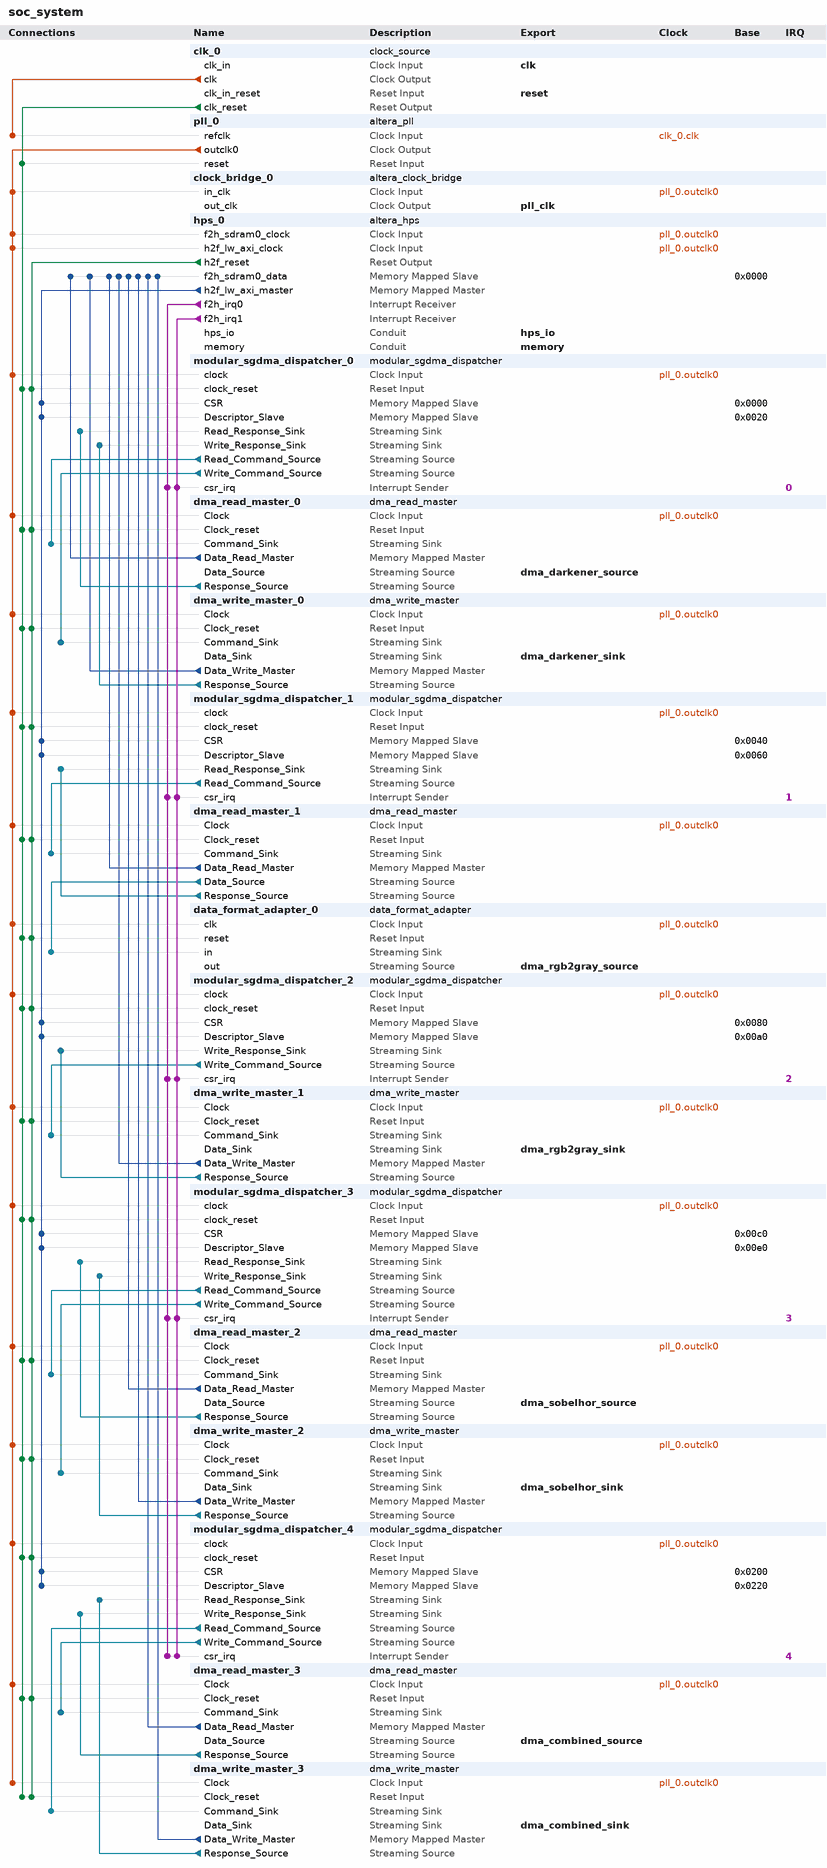
[diagram p0: system contents]
# Platform Designer (Qsys) system soc_system, Cyclone V 5CSEMA5F31C6
# Parameters at their usual value, and those the tool derives, are not listed.
package require -exact qsys 17.1
create_system soc_system
set_project_property DEVICE_FAMILY {Cyclone V}
set_project_property DEVICE 5CSEMA5F31C6

add_instance clk_0 clock_source 17.1
set_instance_parameter_value clk_0 clockFrequency 50000000

add_instance pll_0 altera_pll 17.1
set_instance_parameter_value pll_0 gui_device_speed_grade 1
set_instance_parameter_value pll_0 gui_number_of_clocks 1
set_instance_parameter_value pll_0 gui_operation_mode direct
set_instance_parameter_value pll_0 gui_output_clock_frequency0 100.0
set_instance_parameter_value pll_0 gui_pll_mode {Integer-N PLL}
set_instance_parameter_value pll_0 gui_reference_clock_frequency 50.0
set_instance_parameter_value pll_0 gui_use_locked false

add_instance clock_bridge_0 altera_clock_bridge 17.1
set_instance_parameter_value clock_bridge_0 DERIVED_CLOCK_RATE 100000000
set_instance_parameter_value clock_bridge_0 EXPLICIT_CLOCK_RATE 0

add_instance hps_0 altera_hps 17.1
set_instance_parameter_value hps_0 EMAC1_Mode RGMII
set_instance_parameter_value hps_0 EMAC1_PinMuxing {HPS I/O Set 0}
set_instance_parameter_value hps_0 F2SCLK_COLDRST_Enable false
set_instance_parameter_value hps_0 F2SCLK_DBGRST_Enable false
set_instance_parameter_value hps_0 F2SCLK_WARMRST_Enable false
set_instance_parameter_value hps_0 F2SDRAM_Type {Avalon-MM Bidirectional}
set_instance_parameter_value hps_0 F2SDRAM_Width 64
set_instance_parameter_value hps_0 F2SINTERRUPT_Enable true
set_instance_parameter_value hps_0 F2S_Width 0
set_instance_parameter_value hps_0 FPGA_PERIPHERAL_OUTPUT_CLOCK_FREQ_EMAC0_GTX_CLK 100
set_instance_parameter_value hps_0 FPGA_PERIPHERAL_OUTPUT_CLOCK_FREQ_EMAC0_MD_CLK 100.0
set_instance_parameter_value hps_0 FPGA_PERIPHERAL_OUTPUT_CLOCK_FREQ_EMAC1_GTX_CLK 100
set_instance_parameter_value hps_0 FPGA_PERIPHERAL_OUTPUT_CLOCK_FREQ_EMAC1_MD_CLK 100.0
set_instance_parameter_value hps_0 HPS_PROTOCOL DDR3
set_instance_parameter_value hps_0 I2C0_Mode N/A
set_instance_parameter_value hps_0 I2C0_PinMuxing Unused
set_instance_parameter_value hps_0 I2C1_Mode N/A
set_instance_parameter_value hps_0 I2C1_PinMuxing Unused
set_instance_parameter_value hps_0 LWH2F_Enable true
set_instance_parameter_value hps_0 MEM_BANKADDR_WIDTH 3
set_instance_parameter_value hps_0 MEM_CLK_FREQ 400.0
set_instance_parameter_value hps_0 MEM_COL_ADDR_WIDTH 10
set_instance_parameter_value hps_0 MEM_DQ_WIDTH 32
set_instance_parameter_value hps_0 MEM_DRV_STR RZQ/6
set_instance_parameter_value hps_0 MEM_ROW_ADDR_WIDTH 15
set_instance_parameter_value hps_0 MEM_RTT_NOM RZQ/6
set_instance_parameter_value hps_0 MEM_RTT_WR {Dynamic ODT off}
set_instance_parameter_value hps_0 MEM_TCL 7
set_instance_parameter_value hps_0 MEM_TFAW_NS 45.0
set_instance_parameter_value hps_0 MEM_TRAS_NS 36.0
set_instance_parameter_value hps_0 MEM_TRCD_NS 13.125
set_instance_parameter_value hps_0 MEM_TRFC_NS 300.0
set_instance_parameter_value hps_0 MEM_TRP_NS 13.125
set_instance_parameter_value hps_0 MEM_VENDOR Micron
set_instance_parameter_value hps_0 MEM_WTCL 7
set_instance_parameter_value hps_0 QSPI_Mode N/A
set_instance_parameter_value hps_0 QSPI_PinMuxing Unused
set_instance_parameter_value hps_0 REF_CLK_FREQ 25.0
set_instance_parameter_value hps_0 S2FCLK_USER2CLK 5
set_instance_parameter_value hps_0 S2F_Width 0
set_instance_parameter_value hps_0 SDIO_Mode {4-bit Data}
set_instance_parameter_value hps_0 SDIO_PinMuxing {HPS I/O Set 0}
set_instance_parameter_value hps_0 SPIM1_Mode N/A
set_instance_parameter_value hps_0 SPIM1_PinMuxing Unused
set_instance_parameter_value hps_0 STM_Enable false
set_instance_parameter_value hps_0 TIMING_BOARD_AC_SKEW 0.02
set_instance_parameter_value hps_0 TIMING_BOARD_AC_TO_CK_SKEW 0.01
set_instance_parameter_value hps_0 TIMING_BOARD_DQ_TO_DQS_SKEW 0.05
set_instance_parameter_value hps_0 TIMING_BOARD_MAX_CK_DELAY 0.03
set_instance_parameter_value hps_0 TIMING_BOARD_MAX_DQS_DELAY 0.02
set_instance_parameter_value hps_0 TIMING_BOARD_SKEW_BETWEEN_DQS 0.06
set_instance_parameter_value hps_0 TIMING_BOARD_SKEW_CKDQS_DIMM_MAX 0.12
set_instance_parameter_value hps_0 TIMING_BOARD_SKEW_CKDQS_DIMM_MIN 0.06
set_instance_parameter_value hps_0 TIMING_BOARD_SKEW_WITHIN_DQS 0.01
set_instance_parameter_value hps_0 TIMING_TDH 65
set_instance_parameter_value hps_0 TIMING_TDQSCK 255
set_instance_parameter_value hps_0 TIMING_TDQSQ 125
set_instance_parameter_value hps_0 TIMING_TDS 30
set_instance_parameter_value hps_0 TIMING_TIH 140
set_instance_parameter_value hps_0 TIMING_TIS 190
set_instance_parameter_value hps_0 TIMING_TQSH 0.4
set_instance_parameter_value hps_0 UART0_Mode {No Flow Control}
set_instance_parameter_value hps_0 UART0_PinMuxing {HPS I/O Set 0}
set_instance_parameter_value hps_0 USB1_Mode N/A
set_instance_parameter_value hps_0 USB1_PinMuxing Unused
set_instance_parameter_value hps_0 desired_cfg_clk_mhz 100.0
set_instance_parameter_value hps_0 desired_qspi_clk_mhz 400.0
set_instance_parameter_value hps_0 use_default_mpu_clk false

add_instance modular_sgdma_dispatcher_0 modular_sgdma_dispatcher 17.1
set_instance_parameter_value modular_sgdma_dispatcher_0 BURST_ENABLE 0
set_instance_parameter_value modular_sgdma_dispatcher_0 BURST_WRAPPING_SUPPORT 0
set_instance_parameter_value modular_sgdma_dispatcher_0 CSR_ADDRESS_WIDTH 3
set_instance_parameter_value modular_sgdma_dispatcher_0 DATA_FIFO_DEPTH 32
set_instance_parameter_value modular_sgdma_dispatcher_0 DATA_WIDTH 32
set_instance_parameter_value modular_sgdma_dispatcher_0 DESCRIPTOR_FIFO_DEPTH 8
set_instance_parameter_value modular_sgdma_dispatcher_0 ENHANCED_FEATURES 0
set_instance_parameter_value modular_sgdma_dispatcher_0 GUI_RESPONSE_PORT 2
set_instance_parameter_value modular_sgdma_dispatcher_0 MAX_BURST_COUNT 2
set_instance_parameter_value modular_sgdma_dispatcher_0 MAX_BYTE 1024
set_instance_parameter_value modular_sgdma_dispatcher_0 MAX_STRIDE 1
set_instance_parameter_value modular_sgdma_dispatcher_0 MODE 0
set_instance_parameter_value modular_sgdma_dispatcher_0 PREFETCHER_USE_CASE 0
set_instance_parameter_value modular_sgdma_dispatcher_0 PROGRAMMABLE_BURST_ENABLE 0
set_instance_parameter_value modular_sgdma_dispatcher_0 STRIDE_ENABLE 0
set_instance_parameter_value modular_sgdma_dispatcher_0 TRANSFER_TYPE {Aligned Accesses}

add_instance dma_read_master_0 dma_read_master 17.1
set_instance_parameter_value dma_read_master_0 BURST_ENABLE 1
set_instance_parameter_value dma_read_master_0 CHANNEL_ENABLE 0
set_instance_parameter_value dma_read_master_0 CHANNEL_WIDTH 8
set_instance_parameter_value dma_read_master_0 DATA_WIDTH 8
set_instance_parameter_value dma_read_master_0 ERROR_ENABLE 0
set_instance_parameter_value dma_read_master_0 ERROR_WIDTH 8
set_instance_parameter_value dma_read_master_0 FIFO_DEPTH 64
set_instance_parameter_value dma_read_master_0 FIFO_SPEED_OPTIMIZATION 1
set_instance_parameter_value dma_read_master_0 FIX_ADDRESS_WIDTH 32
set_instance_parameter_value dma_read_master_0 GUI_BURST_WRAPPING_SUPPORT 0
set_instance_parameter_value dma_read_master_0 GUI_MAX_BURST_COUNT 16
set_instance_parameter_value dma_read_master_0 GUI_PROGRAMMABLE_BURST_ENABLE 0
set_instance_parameter_value dma_read_master_0 GUI_STRIDE_WIDTH 1
set_instance_parameter_value dma_read_master_0 LENGTH_WIDTH 32
set_instance_parameter_value dma_read_master_0 PACKET_ENABLE 0
set_instance_parameter_value dma_read_master_0 STRIDE_ENABLE 0
set_instance_parameter_value dma_read_master_0 TRANSFER_TYPE {Aligned Accesses}
set_instance_parameter_value dma_read_master_0 USE_FIX_ADDRESS_WIDTH 0

add_instance dma_write_master_0 dma_write_master 17.1
set_instance_parameter_value dma_write_master_0 BURST_ENABLE 1
set_instance_parameter_value dma_write_master_0 DATA_WIDTH 8
set_instance_parameter_value dma_write_master_0 ERROR_ENABLE 0
set_instance_parameter_value dma_write_master_0 ERROR_WIDTH 8
set_instance_parameter_value dma_write_master_0 FIFO_DEPTH 64
set_instance_parameter_value dma_write_master_0 FIFO_SPEED_OPTIMIZATION 1
set_instance_parameter_value dma_write_master_0 FIX_ADDRESS_WIDTH 32
set_instance_parameter_value dma_write_master_0 GUI_BURST_WRAPPING_SUPPORT 0
set_instance_parameter_value dma_write_master_0 GUI_MAX_BURST_COUNT 16
set_instance_parameter_value dma_write_master_0 GUI_PROGRAMMABLE_BURST_ENABLE 0
set_instance_parameter_value dma_write_master_0 GUI_STRIDE_WIDTH 1
set_instance_parameter_value dma_write_master_0 LENGTH_WIDTH 32
set_instance_parameter_value dma_write_master_0 PACKET_ENABLE 0
set_instance_parameter_value dma_write_master_0 STRIDE_ENABLE 0
set_instance_parameter_value dma_write_master_0 TRANSFER_TYPE {Aligned Accesses}
set_instance_parameter_value dma_write_master_0 USE_FIX_ADDRESS_WIDTH 0

add_instance modular_sgdma_dispatcher_1 modular_sgdma_dispatcher 17.1
set_instance_parameter_value modular_sgdma_dispatcher_1 BURST_ENABLE 0
set_instance_parameter_value modular_sgdma_dispatcher_1 BURST_WRAPPING_SUPPORT 0
set_instance_parameter_value modular_sgdma_dispatcher_1 CSR_ADDRESS_WIDTH 3
set_instance_parameter_value modular_sgdma_dispatcher_1 DATA_FIFO_DEPTH 32
set_instance_parameter_value modular_sgdma_dispatcher_1 DATA_WIDTH 32
set_instance_parameter_value modular_sgdma_dispatcher_1 DESCRIPTOR_FIFO_DEPTH 8
set_instance_parameter_value modular_sgdma_dispatcher_1 ENHANCED_FEATURES 0
set_instance_parameter_value modular_sgdma_dispatcher_1 GUI_RESPONSE_PORT 0
set_instance_parameter_value modular_sgdma_dispatcher_1 MAX_BURST_COUNT 2
set_instance_parameter_value modular_sgdma_dispatcher_1 MAX_BYTE 1024
set_instance_parameter_value modular_sgdma_dispatcher_1 MAX_STRIDE 1
set_instance_parameter_value modular_sgdma_dispatcher_1 MODE 1
set_instance_parameter_value modular_sgdma_dispatcher_1 PREFETCHER_USE_CASE 0
set_instance_parameter_value modular_sgdma_dispatcher_1 PROGRAMMABLE_BURST_ENABLE 0
set_instance_parameter_value modular_sgdma_dispatcher_1 STRIDE_ENABLE 0
set_instance_parameter_value modular_sgdma_dispatcher_1 TRANSFER_TYPE {Aligned Accesses}

add_instance dma_read_master_1 dma_read_master 17.1
set_instance_parameter_value dma_read_master_1 BURST_ENABLE 1
set_instance_parameter_value dma_read_master_1 CHANNEL_ENABLE 0
set_instance_parameter_value dma_read_master_1 CHANNEL_WIDTH 8
set_instance_parameter_value dma_read_master_1 DATA_WIDTH 64
set_instance_parameter_value dma_read_master_1 ERROR_ENABLE 0
set_instance_parameter_value dma_read_master_1 ERROR_WIDTH 8
set_instance_parameter_value dma_read_master_1 FIFO_DEPTH 64
set_instance_parameter_value dma_read_master_1 FIFO_SPEED_OPTIMIZATION 1
set_instance_parameter_value dma_read_master_1 FIX_ADDRESS_WIDTH 32
set_instance_parameter_value dma_read_master_1 GUI_BURST_WRAPPING_SUPPORT 0
set_instance_parameter_value dma_read_master_1 GUI_MAX_BURST_COUNT 16
set_instance_parameter_value dma_read_master_1 GUI_PROGRAMMABLE_BURST_ENABLE 0
set_instance_parameter_value dma_read_master_1 GUI_STRIDE_WIDTH 1
set_instance_parameter_value dma_read_master_1 LENGTH_WIDTH 32
set_instance_parameter_value dma_read_master_1 PACKET_ENABLE 0
set_instance_parameter_value dma_read_master_1 STRIDE_ENABLE 0
set_instance_parameter_value dma_read_master_1 TRANSFER_TYPE {Aligned Accesses}
set_instance_parameter_value dma_read_master_1 USE_FIX_ADDRESS_WIDTH 0

add_instance data_format_adapter_0 data_format_adapter 17.1
set_instance_parameter_value data_format_adapter_0 inBitsPerSymbol 8
set_instance_parameter_value data_format_adapter_0 inChannelWidth 0
set_instance_parameter_value data_format_adapter_0 inErrorWidth 0
set_instance_parameter_value data_format_adapter_0 inMaxChannel 0
set_instance_parameter_value data_format_adapter_0 inReadyLatency 0
set_instance_parameter_value data_format_adapter_0 inSymbolsPerBeat 8
set_instance_parameter_value data_format_adapter_0 inUseEmpty false
set_instance_parameter_value data_format_adapter_0 inUseEmptyPort AUTO
set_instance_parameter_value data_format_adapter_0 inUsePackets false
set_instance_parameter_value data_format_adapter_0 outSymbolsPerBeat 3
set_instance_parameter_value data_format_adapter_0 outUseEmpty false
set_instance_parameter_value data_format_adapter_0 outUseEmptyPort AUTO

add_instance modular_sgdma_dispatcher_2 modular_sgdma_dispatcher 17.1
set_instance_parameter_value modular_sgdma_dispatcher_2 BURST_ENABLE 0
set_instance_parameter_value modular_sgdma_dispatcher_2 BURST_WRAPPING_SUPPORT 0
set_instance_parameter_value modular_sgdma_dispatcher_2 CSR_ADDRESS_WIDTH 3
set_instance_parameter_value modular_sgdma_dispatcher_2 DATA_FIFO_DEPTH 32
set_instance_parameter_value modular_sgdma_dispatcher_2 DATA_WIDTH 32
set_instance_parameter_value modular_sgdma_dispatcher_2 DESCRIPTOR_FIFO_DEPTH 8
set_instance_parameter_value modular_sgdma_dispatcher_2 ENHANCED_FEATURES 0
set_instance_parameter_value modular_sgdma_dispatcher_2 GUI_RESPONSE_PORT 2
set_instance_parameter_value modular_sgdma_dispatcher_2 MAX_BURST_COUNT 2
set_instance_parameter_value modular_sgdma_dispatcher_2 MAX_BYTE 1024
set_instance_parameter_value modular_sgdma_dispatcher_2 MAX_STRIDE 1
set_instance_parameter_value modular_sgdma_dispatcher_2 MODE 2
set_instance_parameter_value modular_sgdma_dispatcher_2 PREFETCHER_USE_CASE 0
set_instance_parameter_value modular_sgdma_dispatcher_2 PROGRAMMABLE_BURST_ENABLE 0
set_instance_parameter_value modular_sgdma_dispatcher_2 STRIDE_ENABLE 0
set_instance_parameter_value modular_sgdma_dispatcher_2 TRANSFER_TYPE {Aligned Accesses}

add_instance dma_write_master_1 dma_write_master 17.1
set_instance_parameter_value dma_write_master_1 BURST_ENABLE 1
set_instance_parameter_value dma_write_master_1 DATA_WIDTH 8
set_instance_parameter_value dma_write_master_1 ERROR_ENABLE 0
set_instance_parameter_value dma_write_master_1 ERROR_WIDTH 8
set_instance_parameter_value dma_write_master_1 FIFO_DEPTH 64
set_instance_parameter_value dma_write_master_1 FIFO_SPEED_OPTIMIZATION 1
set_instance_parameter_value dma_write_master_1 FIX_ADDRESS_WIDTH 32
set_instance_parameter_value dma_write_master_1 GUI_BURST_WRAPPING_SUPPORT 0
set_instance_parameter_value dma_write_master_1 GUI_MAX_BURST_COUNT 16
set_instance_parameter_value dma_write_master_1 GUI_PROGRAMMABLE_BURST_ENABLE 0
set_instance_parameter_value dma_write_master_1 GUI_STRIDE_WIDTH 1
set_instance_parameter_value dma_write_master_1 LENGTH_WIDTH 32
set_instance_parameter_value dma_write_master_1 PACKET_ENABLE 0
set_instance_parameter_value dma_write_master_1 STRIDE_ENABLE 0
set_instance_parameter_value dma_write_master_1 TRANSFER_TYPE {Aligned Accesses}
set_instance_parameter_value dma_write_master_1 USE_FIX_ADDRESS_WIDTH 0

add_instance modular_sgdma_dispatcher_3 modular_sgdma_dispatcher 17.1
set_instance_parameter_value modular_sgdma_dispatcher_3 BURST_ENABLE 0
set_instance_parameter_value modular_sgdma_dispatcher_3 BURST_WRAPPING_SUPPORT 0
set_instance_parameter_value modular_sgdma_dispatcher_3 CSR_ADDRESS_WIDTH 3
set_instance_parameter_value modular_sgdma_dispatcher_3 DATA_FIFO_DEPTH 32
set_instance_parameter_value modular_sgdma_dispatcher_3 DATA_WIDTH 32
set_instance_parameter_value modular_sgdma_dispatcher_3 DESCRIPTOR_FIFO_DEPTH 8
set_instance_parameter_value modular_sgdma_dispatcher_3 ENHANCED_FEATURES 0
set_instance_parameter_value modular_sgdma_dispatcher_3 GUI_RESPONSE_PORT 2
set_instance_parameter_value modular_sgdma_dispatcher_3 MAX_BURST_COUNT 2
set_instance_parameter_value modular_sgdma_dispatcher_3 MAX_BYTE 1024
set_instance_parameter_value modular_sgdma_dispatcher_3 MAX_STRIDE 1
set_instance_parameter_value modular_sgdma_dispatcher_3 MODE 0
set_instance_parameter_value modular_sgdma_dispatcher_3 PREFETCHER_USE_CASE 0
set_instance_parameter_value modular_sgdma_dispatcher_3 PROGRAMMABLE_BURST_ENABLE 0
set_instance_parameter_value modular_sgdma_dispatcher_3 STRIDE_ENABLE 0
set_instance_parameter_value modular_sgdma_dispatcher_3 TRANSFER_TYPE {Aligned Accesses}

add_instance dma_read_master_2 dma_read_master 17.1
set_instance_parameter_value dma_read_master_2 BURST_ENABLE 1
set_instance_parameter_value dma_read_master_2 CHANNEL_ENABLE 0
set_instance_parameter_value dma_read_master_2 CHANNEL_WIDTH 8
set_instance_parameter_value dma_read_master_2 DATA_WIDTH 8
set_instance_parameter_value dma_read_master_2 ERROR_ENABLE 0
set_instance_parameter_value dma_read_master_2 ERROR_WIDTH 8
set_instance_parameter_value dma_read_master_2 FIFO_DEPTH 64
set_instance_parameter_value dma_read_master_2 FIFO_SPEED_OPTIMIZATION 1
set_instance_parameter_value dma_read_master_2 FIX_ADDRESS_WIDTH 32
set_instance_parameter_value dma_read_master_2 GUI_BURST_WRAPPING_SUPPORT 0
set_instance_parameter_value dma_read_master_2 GUI_MAX_BURST_COUNT 16
set_instance_parameter_value dma_read_master_2 GUI_PROGRAMMABLE_BURST_ENABLE 0
set_instance_parameter_value dma_read_master_2 GUI_STRIDE_WIDTH 1
set_instance_parameter_value dma_read_master_2 LENGTH_WIDTH 32
set_instance_parameter_value dma_read_master_2 PACKET_ENABLE 0
set_instance_parameter_value dma_read_master_2 STRIDE_ENABLE 0
set_instance_parameter_value dma_read_master_2 TRANSFER_TYPE {Aligned Accesses}
set_instance_parameter_value dma_read_master_2 USE_FIX_ADDRESS_WIDTH 0

add_instance dma_write_master_2 dma_write_master 17.1
set_instance_parameter_value dma_write_master_2 BURST_ENABLE 1
set_instance_parameter_value dma_write_master_2 DATA_WIDTH 8
set_instance_parameter_value dma_write_master_2 ERROR_ENABLE 0
set_instance_parameter_value dma_write_master_2 ERROR_WIDTH 8
set_instance_parameter_value dma_write_master_2 FIFO_DEPTH 64
set_instance_parameter_value dma_write_master_2 FIFO_SPEED_OPTIMIZATION 1
set_instance_parameter_value dma_write_master_2 FIX_ADDRESS_WIDTH 32
set_instance_parameter_value dma_write_master_2 GUI_BURST_WRAPPING_SUPPORT 0
set_instance_parameter_value dma_write_master_2 GUI_MAX_BURST_COUNT 16
set_instance_parameter_value dma_write_master_2 GUI_PROGRAMMABLE_BURST_ENABLE 0
set_instance_parameter_value dma_write_master_2 GUI_STRIDE_WIDTH 1
set_instance_parameter_value dma_write_master_2 LENGTH_WIDTH 32
set_instance_parameter_value dma_write_master_2 PACKET_ENABLE 0
set_instance_parameter_value dma_write_master_2 STRIDE_ENABLE 0
set_instance_parameter_value dma_write_master_2 TRANSFER_TYPE {Aligned Accesses}
set_instance_parameter_value dma_write_master_2 USE_FIX_ADDRESS_WIDTH 0

add_instance modular_sgdma_dispatcher_4 modular_sgdma_dispatcher 17.1
set_instance_parameter_value modular_sgdma_dispatcher_4 BURST_ENABLE 0
set_instance_parameter_value modular_sgdma_dispatcher_4 BURST_WRAPPING_SUPPORT 0
set_instance_parameter_value modular_sgdma_dispatcher_4 CSR_ADDRESS_WIDTH 3
set_instance_parameter_value modular_sgdma_dispatcher_4 DATA_FIFO_DEPTH 32
set_instance_parameter_value modular_sgdma_dispatcher_4 DATA_WIDTH 32
set_instance_parameter_value modular_sgdma_dispatcher_4 DESCRIPTOR_FIFO_DEPTH 8
set_instance_parameter_value modular_sgdma_dispatcher_4 ENHANCED_FEATURES 0
set_instance_parameter_value modular_sgdma_dispatcher_4 GUI_RESPONSE_PORT 2
set_instance_parameter_value modular_sgdma_dispatcher_4 MAX_BURST_COUNT 2
set_instance_parameter_value modular_sgdma_dispatcher_4 MAX_BYTE 1024
set_instance_parameter_value modular_sgdma_dispatcher_4 MAX_STRIDE 1
set_instance_parameter_value modular_sgdma_dispatcher_4 MODE 0
set_instance_parameter_value modular_sgdma_dispatcher_4 PREFETCHER_USE_CASE 0
set_instance_parameter_value modular_sgdma_dispatcher_4 PROGRAMMABLE_BURST_ENABLE 0
set_instance_parameter_value modular_sgdma_dispatcher_4 STRIDE_ENABLE 0
set_instance_parameter_value modular_sgdma_dispatcher_4 TRANSFER_TYPE {Aligned Accesses}

add_instance dma_read_master_3 dma_read_master 17.1
set_instance_parameter_value dma_read_master_3 BURST_ENABLE 1
set_instance_parameter_value dma_read_master_3 CHANNEL_ENABLE 0
set_instance_parameter_value dma_read_master_3 CHANNEL_WIDTH 8
set_instance_parameter_value dma_read_master_3 DATA_WIDTH 8
set_instance_parameter_value dma_read_master_3 ERROR_ENABLE 0
set_instance_parameter_value dma_read_master_3 ERROR_WIDTH 8
set_instance_parameter_value dma_read_master_3 FIFO_DEPTH 64
set_instance_parameter_value dma_read_master_3 FIFO_SPEED_OPTIMIZATION 1
set_instance_parameter_value dma_read_master_3 FIX_ADDRESS_WIDTH 32
set_instance_parameter_value dma_read_master_3 GUI_BURST_WRAPPING_SUPPORT 0
set_instance_parameter_value dma_read_master_3 GUI_MAX_BURST_COUNT 16
set_instance_parameter_value dma_read_master_3 GUI_PROGRAMMABLE_BURST_ENABLE 0
set_instance_parameter_value dma_read_master_3 GUI_STRIDE_WIDTH 1
set_instance_parameter_value dma_read_master_3 LENGTH_WIDTH 32
set_instance_parameter_value dma_read_master_3 PACKET_ENABLE 0
set_instance_parameter_value dma_read_master_3 STRIDE_ENABLE 0
set_instance_parameter_value dma_read_master_3 TRANSFER_TYPE {Aligned Accesses}
set_instance_parameter_value dma_read_master_3 USE_FIX_ADDRESS_WIDTH 0

add_instance dma_write_master_3 dma_write_master 17.1
set_instance_parameter_value dma_write_master_3 BURST_ENABLE 1
set_instance_parameter_value dma_write_master_3 DATA_WIDTH 8
set_instance_parameter_value dma_write_master_3 ERROR_ENABLE 0
set_instance_parameter_value dma_write_master_3 ERROR_WIDTH 8
set_instance_parameter_value dma_write_master_3 FIFO_DEPTH 64
set_instance_parameter_value dma_write_master_3 FIFO_SPEED_OPTIMIZATION 1
set_instance_parameter_value dma_write_master_3 FIX_ADDRESS_WIDTH 32
set_instance_parameter_value dma_write_master_3 GUI_BURST_WRAPPING_SUPPORT 0
set_instance_parameter_value dma_write_master_3 GUI_MAX_BURST_COUNT 16
set_instance_parameter_value dma_write_master_3 GUI_PROGRAMMABLE_BURST_ENABLE 0
set_instance_parameter_value dma_write_master_3 GUI_STRIDE_WIDTH 1
set_instance_parameter_value dma_write_master_3 LENGTH_WIDTH 32
set_instance_parameter_value dma_write_master_3 PACKET_ENABLE 0
set_instance_parameter_value dma_write_master_3 STRIDE_ENABLE 0
set_instance_parameter_value dma_write_master_3 TRANSFER_TYPE {Aligned Accesses}
set_instance_parameter_value dma_write_master_3 USE_FIX_ADDRESS_WIDTH 0

# connections
add_connection clk_0.clk pll_0.refclk clock
add_connection pll_0.outclk0 clock_bridge_0.in_clk clock
add_connection pll_0.outclk0 data_format_adapter_0.clk clock
add_connection pll_0.outclk0 dma_read_master_0.Clock clock
add_connection pll_0.outclk0 dma_read_master_1.Clock clock
add_connection pll_0.outclk0 dma_read_master_2.Clock clock
add_connection pll_0.outclk0 dma_read_master_3.Clock clock
add_connection pll_0.outclk0 dma_write_master_0.Clock clock
add_connection pll_0.outclk0 dma_write_master_1.Clock clock
add_connection pll_0.outclk0 dma_write_master_2.Clock clock
add_connection pll_0.outclk0 dma_write_master_3.Clock clock
add_connection pll_0.outclk0 hps_0.f2h_sdram0_clock clock
add_connection pll_0.outclk0 hps_0.h2f_lw_axi_clock clock
add_connection pll_0.outclk0 modular_sgdma_dispatcher_0.clock clock
add_connection pll_0.outclk0 modular_sgdma_dispatcher_1.clock clock
add_connection pll_0.outclk0 modular_sgdma_dispatcher_2.clock clock
add_connection pll_0.outclk0 modular_sgdma_dispatcher_3.clock clock
add_connection pll_0.outclk0 modular_sgdma_dispatcher_4.clock clock
add_connection clk_0.clk_reset data_format_adapter_0.reset reset
add_connection clk_0.clk_reset dma_read_master_0.Clock_reset reset
add_connection clk_0.clk_reset dma_read_master_1.Clock_reset reset
add_connection clk_0.clk_reset dma_read_master_2.Clock_reset reset
add_connection clk_0.clk_reset dma_read_master_3.Clock_reset reset
add_connection clk_0.clk_reset dma_write_master_0.Clock_reset reset
add_connection clk_0.clk_reset dma_write_master_1.Clock_reset reset
add_connection clk_0.clk_reset dma_write_master_2.Clock_reset reset
add_connection clk_0.clk_reset dma_write_master_3.Clock_reset reset
add_connection clk_0.clk_reset modular_sgdma_dispatcher_0.clock_reset reset
add_connection clk_0.clk_reset modular_sgdma_dispatcher_1.clock_reset reset
add_connection clk_0.clk_reset modular_sgdma_dispatcher_2.clock_reset reset
add_connection clk_0.clk_reset modular_sgdma_dispatcher_3.clock_reset reset
add_connection clk_0.clk_reset modular_sgdma_dispatcher_4.clock_reset reset
add_connection clk_0.clk_reset pll_0.reset reset
add_connection hps_0.h2f_reset data_format_adapter_0.reset reset
add_connection hps_0.h2f_reset dma_read_master_0.Clock_reset reset
add_connection hps_0.h2f_reset dma_read_master_1.Clock_reset reset
add_connection hps_0.h2f_reset dma_read_master_2.Clock_reset reset
add_connection hps_0.h2f_reset dma_read_master_3.Clock_reset reset
add_connection hps_0.h2f_reset dma_write_master_0.Clock_reset reset
add_connection hps_0.h2f_reset dma_write_master_1.Clock_reset reset
add_connection hps_0.h2f_reset dma_write_master_2.Clock_reset reset
add_connection hps_0.h2f_reset dma_write_master_3.Clock_reset reset
add_connection hps_0.h2f_reset modular_sgdma_dispatcher_0.clock_reset reset
add_connection hps_0.h2f_reset modular_sgdma_dispatcher_1.clock_reset reset
add_connection hps_0.h2f_reset modular_sgdma_dispatcher_2.clock_reset reset
add_connection hps_0.h2f_reset modular_sgdma_dispatcher_3.clock_reset reset
add_connection hps_0.h2f_reset modular_sgdma_dispatcher_4.clock_reset reset
add_connection dma_read_master_0.Data_Read_Master hps_0.f2h_sdram0_data avalon
set_connection_parameter_value dma_read_master_0.Data_Read_Master/hps_0.f2h_sdram0_data baseAddress 0x0000
add_connection dma_read_master_1.Data_Read_Master hps_0.f2h_sdram0_data avalon
set_connection_parameter_value dma_read_master_1.Data_Read_Master/hps_0.f2h_sdram0_data baseAddress 0x0000
add_connection dma_read_master_2.Data_Read_Master hps_0.f2h_sdram0_data avalon
set_connection_parameter_value dma_read_master_2.Data_Read_Master/hps_0.f2h_sdram0_data baseAddress 0x0000
add_connection dma_read_master_3.Data_Read_Master hps_0.f2h_sdram0_data avalon
set_connection_parameter_value dma_read_master_3.Data_Read_Master/hps_0.f2h_sdram0_data baseAddress 0x0000
add_connection dma_write_master_0.Data_Write_Master hps_0.f2h_sdram0_data avalon
set_connection_parameter_value dma_write_master_0.Data_Write_Master/hps_0.f2h_sdram0_data baseAddress 0x0000
add_connection dma_write_master_1.Data_Write_Master hps_0.f2h_sdram0_data avalon
set_connection_parameter_value dma_write_master_1.Data_Write_Master/hps_0.f2h_sdram0_data baseAddress 0x0000
add_connection dma_write_master_2.Data_Write_Master hps_0.f2h_sdram0_data avalon
set_connection_parameter_value dma_write_master_2.Data_Write_Master/hps_0.f2h_sdram0_data baseAddress 0x0000
add_connection dma_write_master_3.Data_Write_Master hps_0.f2h_sdram0_data avalon
set_connection_parameter_value dma_write_master_3.Data_Write_Master/hps_0.f2h_sdram0_data baseAddress 0x0000
add_connection hps_0.h2f_lw_axi_master modular_sgdma_dispatcher_0.CSR avalon
set_connection_parameter_value hps_0.h2f_lw_axi_master/modular_sgdma_dispatcher_0.CSR baseAddress 0x0000
add_connection hps_0.h2f_lw_axi_master modular_sgdma_dispatcher_0.Descriptor_Slave avalon
set_connection_parameter_value hps_0.h2f_lw_axi_master/modular_sgdma_dispatcher_0.Descriptor_Slave baseAddress 0x0020
add_connection hps_0.h2f_lw_axi_master modular_sgdma_dispatcher_1.CSR avalon
set_connection_parameter_value hps_0.h2f_lw_axi_master/modular_sgdma_dispatcher_1.CSR baseAddress 0x0040
add_connection hps_0.h2f_lw_axi_master modular_sgdma_dispatcher_1.Descriptor_Slave avalon
set_connection_parameter_value hps_0.h2f_lw_axi_master/modular_sgdma_dispatcher_1.Descriptor_Slave baseAddress 0x0060
add_connection hps_0.h2f_lw_axi_master modular_sgdma_dispatcher_2.CSR avalon
set_connection_parameter_value hps_0.h2f_lw_axi_master/modular_sgdma_dispatcher_2.CSR baseAddress 0x0080
add_connection hps_0.h2f_lw_axi_master modular_sgdma_dispatcher_2.Descriptor_Slave avalon
set_connection_parameter_value hps_0.h2f_lw_axi_master/modular_sgdma_dispatcher_2.Descriptor_Slave baseAddress 0x00a0
add_connection hps_0.h2f_lw_axi_master modular_sgdma_dispatcher_3.CSR avalon
set_connection_parameter_value hps_0.h2f_lw_axi_master/modular_sgdma_dispatcher_3.CSR baseAddress 0x00c0
add_connection hps_0.h2f_lw_axi_master modular_sgdma_dispatcher_3.Descriptor_Slave avalon
set_connection_parameter_value hps_0.h2f_lw_axi_master/modular_sgdma_dispatcher_3.Descriptor_Slave baseAddress 0x00e0
add_connection hps_0.h2f_lw_axi_master modular_sgdma_dispatcher_4.CSR avalon
set_connection_parameter_value hps_0.h2f_lw_axi_master/modular_sgdma_dispatcher_4.CSR baseAddress 0x0200
add_connection hps_0.h2f_lw_axi_master modular_sgdma_dispatcher_4.Descriptor_Slave avalon
set_connection_parameter_value hps_0.h2f_lw_axi_master/modular_sgdma_dispatcher_4.Descriptor_Slave baseAddress 0x0220
add_connection dma_read_master_0.Response_Source modular_sgdma_dispatcher_0.Read_Response_Sink avalon_streaming
add_connection dma_read_master_1.Data_Source data_format_adapter_0.in avalon_streaming
add_connection dma_read_master_1.Response_Source modular_sgdma_dispatcher_1.Read_Response_Sink avalon_streaming
add_connection dma_read_master_2.Response_Source modular_sgdma_dispatcher_3.Read_Response_Sink avalon_streaming
add_connection dma_read_master_3.Response_Source modular_sgdma_dispatcher_4.Write_Response_Sink avalon_streaming
add_connection dma_write_master_0.Response_Source modular_sgdma_dispatcher_0.Write_Response_Sink avalon_streaming
add_connection dma_write_master_1.Response_Source modular_sgdma_dispatcher_2.Write_Response_Sink avalon_streaming
add_connection dma_write_master_2.Response_Source modular_sgdma_dispatcher_3.Write_Response_Sink avalon_streaming
add_connection dma_write_master_3.Response_Source modular_sgdma_dispatcher_4.Read_Response_Sink avalon_streaming
add_connection modular_sgdma_dispatcher_0.Read_Command_Source dma_read_master_0.Command_Sink avalon_streaming
add_connection modular_sgdma_dispatcher_0.Write_Command_Source dma_write_master_0.Command_Sink avalon_streaming
add_connection modular_sgdma_dispatcher_1.Read_Command_Source dma_read_master_1.Command_Sink avalon_streaming
add_connection modular_sgdma_dispatcher_2.Write_Command_Source dma_write_master_1.Command_Sink avalon_streaming
add_connection modular_sgdma_dispatcher_3.Read_Command_Source dma_read_master_2.Command_Sink avalon_streaming
add_connection modular_sgdma_dispatcher_3.Write_Command_Source dma_write_master_2.Command_Sink avalon_streaming
add_connection modular_sgdma_dispatcher_4.Read_Command_Source dma_write_master_3.Command_Sink avalon_streaming
add_connection modular_sgdma_dispatcher_4.Write_Command_Source dma_read_master_3.Command_Sink avalon_streaming
add_connection hps_0.f2h_irq0 modular_sgdma_dispatcher_0.csr_irq interrupt
set_connection_parameter_value hps_0.f2h_irq0/modular_sgdma_dispatcher_0.csr_irq irqNumber 0
add_connection hps_0.f2h_irq0 modular_sgdma_dispatcher_1.csr_irq interrupt
set_connection_parameter_value hps_0.f2h_irq0/modular_sgdma_dispatcher_1.csr_irq irqNumber 1
add_connection hps_0.f2h_irq0 modular_sgdma_dispatcher_2.csr_irq interrupt
set_connection_parameter_value hps_0.f2h_irq0/modular_sgdma_dispatcher_2.csr_irq irqNumber 2
add_connection hps_0.f2h_irq0 modular_sgdma_dispatcher_3.csr_irq interrupt
set_connection_parameter_value hps_0.f2h_irq0/modular_sgdma_dispatcher_3.csr_irq irqNumber 3
add_connection hps_0.f2h_irq0 modular_sgdma_dispatcher_4.csr_irq interrupt
set_connection_parameter_value hps_0.f2h_irq0/modular_sgdma_dispatcher_4.csr_irq irqNumber 4
add_connection hps_0.f2h_irq1 modular_sgdma_dispatcher_0.csr_irq interrupt
set_connection_parameter_value hps_0.f2h_irq1/modular_sgdma_dispatcher_0.csr_irq irqNumber 0
add_connection hps_0.f2h_irq1 modular_sgdma_dispatcher_1.csr_irq interrupt
set_connection_parameter_value hps_0.f2h_irq1/modular_sgdma_dispatcher_1.csr_irq irqNumber 1
add_connection hps_0.f2h_irq1 modular_sgdma_dispatcher_2.csr_irq interrupt
set_connection_parameter_value hps_0.f2h_irq1/modular_sgdma_dispatcher_2.csr_irq irqNumber 2
add_connection hps_0.f2h_irq1 modular_sgdma_dispatcher_3.csr_irq interrupt
set_connection_parameter_value hps_0.f2h_irq1/modular_sgdma_dispatcher_3.csr_irq irqNumber 3
add_connection hps_0.f2h_irq1 modular_sgdma_dispatcher_4.csr_irq interrupt
set_connection_parameter_value hps_0.f2h_irq1/modular_sgdma_dispatcher_4.csr_irq irqNumber 4

# exported interfaces
add_interface clk clock sink
set_interface_property clk EXPORT_OF clk_0.clk_in
add_interface dma_combined_sink avalon_streaming sink
set_interface_property dma_combined_sink EXPORT_OF dma_write_master_3.Data_Sink
add_interface dma_combined_source avalon_streaming source
set_interface_property dma_combined_source EXPORT_OF dma_read_master_3.Data_Source
add_interface dma_darkener_sink avalon_streaming sink
set_interface_property dma_darkener_sink EXPORT_OF dma_write_master_0.Data_Sink
add_interface dma_darkener_source avalon_streaming source
set_interface_property dma_darkener_source EXPORT_OF dma_read_master_0.Data_Source
add_interface dma_rgb2gray_sink avalon_streaming sink
set_interface_property dma_rgb2gray_sink EXPORT_OF dma_write_master_1.Data_Sink
add_interface dma_rgb2gray_source avalon_streaming source
set_interface_property dma_rgb2gray_source EXPORT_OF data_format_adapter_0.out
add_interface dma_sobelhor_sink avalon_streaming sink
set_interface_property dma_sobelhor_sink EXPORT_OF dma_write_master_2.Data_Sink
add_interface dma_sobelhor_source avalon_streaming source
set_interface_property dma_sobelhor_source EXPORT_OF dma_read_master_2.Data_Source
add_interface hps_io conduit end
set_interface_property hps_io EXPORT_OF hps_0.hps_io
add_interface memory conduit end
set_interface_property memory EXPORT_OF hps_0.memory
add_interface pll_clk clock source
set_interface_property pll_clk EXPORT_OF clock_bridge_0.out_clk
add_interface reset reset sink
set_interface_property reset EXPORT_OF clk_0.clk_in_reset

set_interconnect_requirement {$system} qsys_mm.clockCrossingAdapter HANDSHAKE
set_interconnect_requirement {$system} qsys_mm.enableEccProtection FALSE
set_interconnect_requirement {$system} qsys_mm.insertDefaultSlave FALSE
set_interconnect_requirement {$system} qsys_mm.maxAdditionalLatency 1

save_system soc_system.qsys
